# EAGLE design ROCKBLOCK_interface (EAGLE 9.2.2)
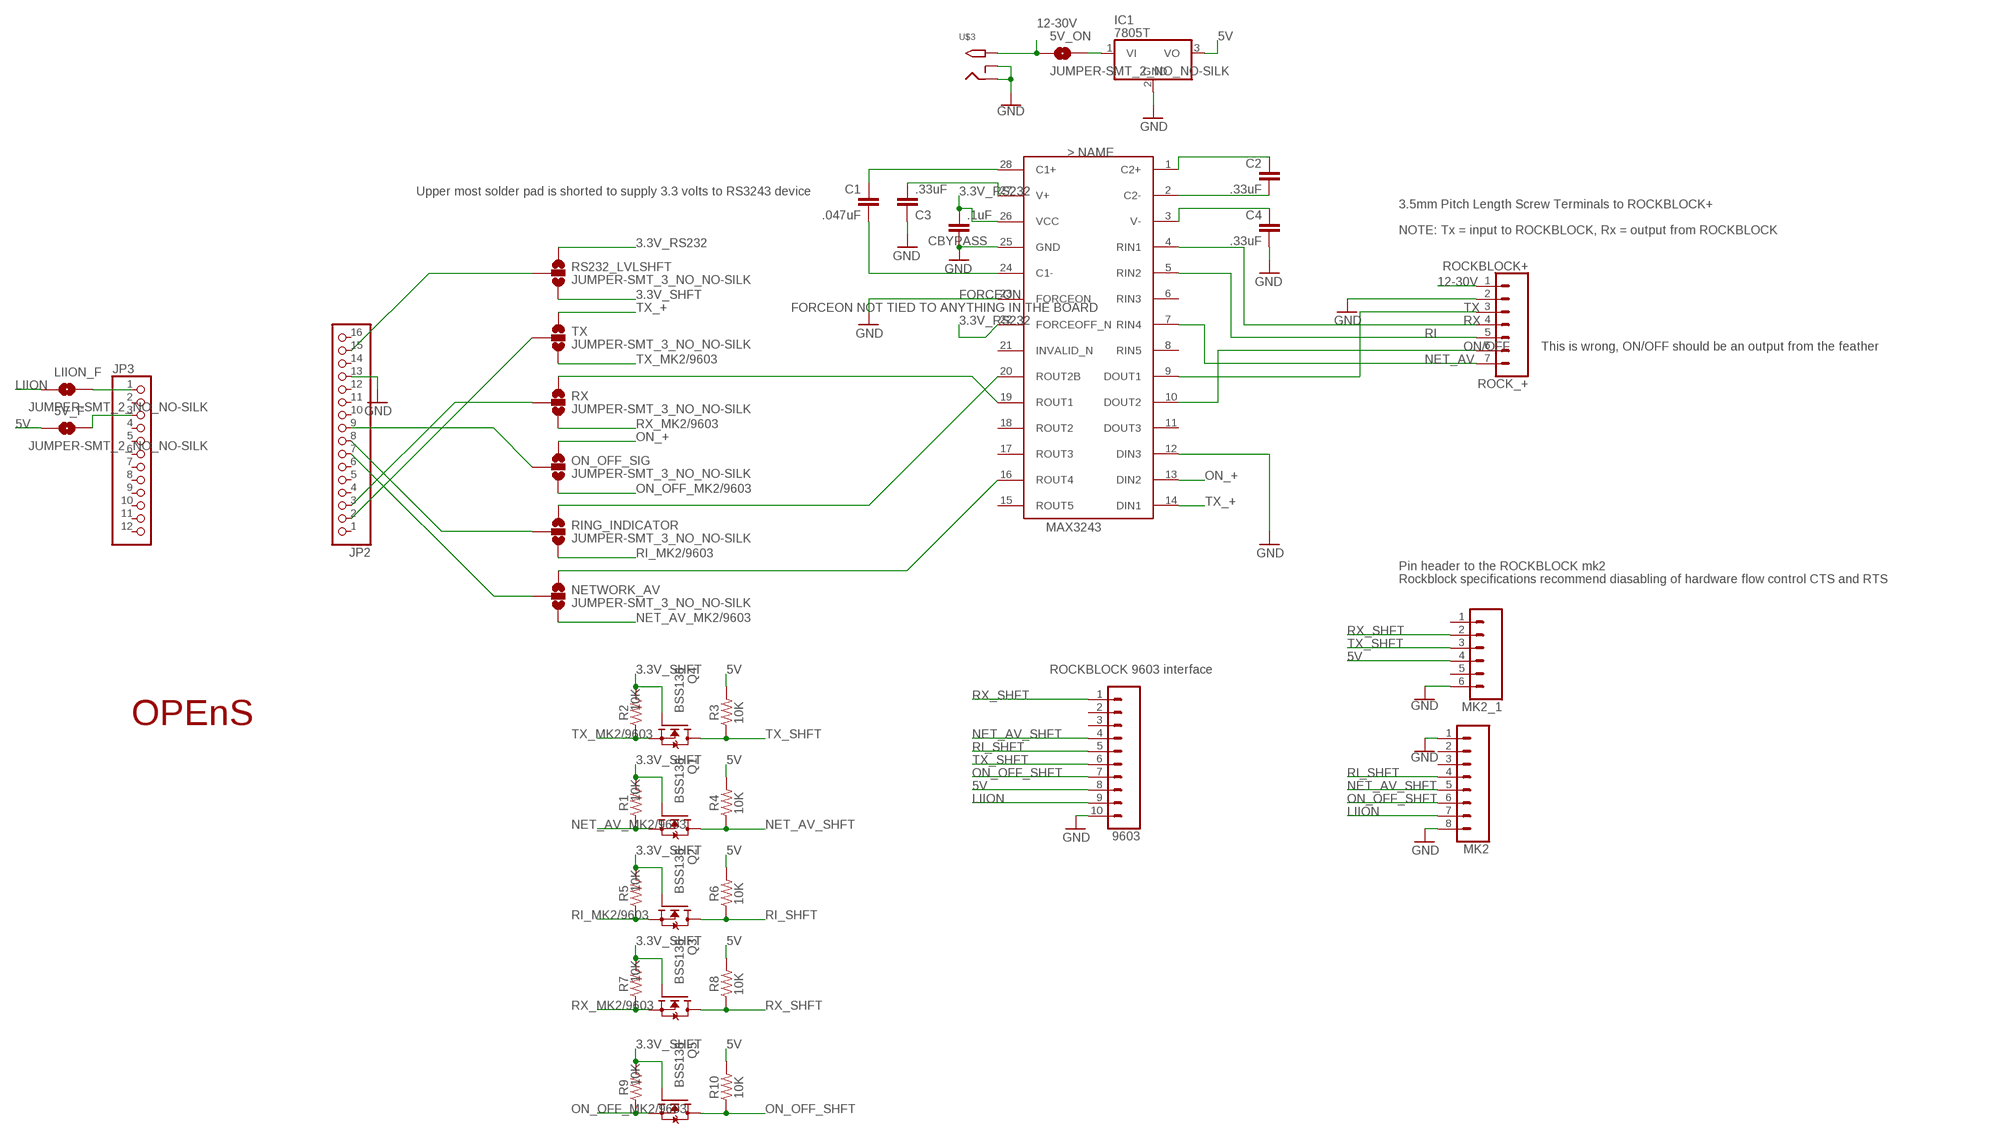
[diagram p0: schematic, sheet 1]

## Parts
5V_F  JUMPER-SMT_2_NO_NO-SILK  [SMT-JUMPER_2_NO_NO-SILK]
5V_ON  JUMPER-SMT_2_NO_NO-SILK  [SMT-JUMPER_2_NO_NO-SILK]
9603  CONN_10"  [1X10]
C1  .047uF  CC1206  [C1206]
C2  .33uF  CC1206  [C1206]
C3  .33uF  CC1206  [C1206]
C4  .33uF  CC1206  [C1206]
CBYPASS  .1uF  CC1206  [C1206]
IC1  7805T  [TO220H]
JP2  PINHD-1X16  [1X16]
JP3  PINHD-1X12  [1X12]
LIION_F  JUMPER-SMT_2_NO_NO-SILK  [SMT-JUMPER_2_NO_NO-SILK]
MK2  CONN_08NO_SILK_FEMALE_PTH  [1X08_NO_SILK]
MK2_1  CONN_06NO_SILK_FEMALE_PTH  [1X06_NO_SILK]
NETWORK_AV  JUMPER-SMT_3_NO_NO-SILK  [SMT-JUMPER_3_NO_NO-SILK]
ON_OFF_SIG  JUMPER-SMT_3_NO_NO-SILK  [SMT-JUMPER_3_NO_NO-SILK]
Q1  BSS138  [SOT23]
Q2  BSS138  [SOT23]
Q3  BSS138  [SOT23]
Q4  BSS138  [SOT23]
Q5  BSS138  [SOT23]
R1  10K  1.8MOHM  [0603]
R2  10K  1.8MOHM  [0603]
R3  10K  1.8MOHM  [0603]
R4  10K  1.8MOHM  [0603]
R5  10K  1.8MOHM  [0603]
R6  10K  1.8MOHM  [0603]
R7  10K  1.8MOHM  [0603]
R8  10K  1.8MOHM  [0603]
R9  10K  1.8MOHM  [0603]
R10  10K  1.8MOHM  [0603]
RING_INDICATOR  JUMPER-SMT_3_NO_NO-SILK  [SMT-JUMPER_3_NO_NO-SILK]
ROCK_+  ROCKBLOCK+  CONN_073.5MM-7  [SCREWTERMINAL-3.5MM-7]
RS232_LVLSHFT  JUMPER-SMT_3_NO_NO-SILK  [SMT-JUMPER_3_NO_NO-SILK]
RX  JUMPER-SMT_3_NO_NO-SILK  [SMT-JUMPER_3_NO_NO-SILK]
TX  JUMPER-SMT_3_NO_NO-SILK  [SMT-JUMPER_3_NO_NO-SILK]
U$1  MAX3243  [SSOP-28]
U$2  OPENS-LOGO  [OPENS-LOGO]
U$3  2.1MMJACKTHM  [PJ-102A]

## Nets
3.3V_RS232: CBYPASS.2 RS232_LVLSHFT.1 U$1.22(FORCEOFF_N) U$1.26(VCC)
3.3V_SHFT: Q1.1(G) Q2.1(G) Q3.1(G) Q4.1(G) Q5.1(G) R1.2 R2.2 R5.2 R7.2 R9.2 RS232_LVLSHFT.3
5V: 5V_F.1 9603.8 IC1.3(VO) MK2_1.4 R3.2 R4.2 R6.2 R8.2 R10.2
12-30V: 5V_ON.1 ROCK_+.1 U$3.TIP
C1+: C1.1 U$1.28(C1+)
FORCEON: U$1.23(FORCEON) ; supply symbol labelled GND
GND: 9603.10 C3.1 C4.2 CBYPASS.1 IC1.2(GND) JP2.13 MK2.1 MK2.8 MK2_1.6 ROCK_+.2 U$1.12(DIN3) U$1.25(GND) U$3.RING U$3.RING_SW
LIION: 9603.9 LIION_F.1 MK2.7
N$1: C2.1 U$1.1(C2+)
N$2: C2.2 U$1.2(C2-)
N$3: C4.1 U$1.3(V-)
N$4: JP2.2 TX.2
N$5: 5V_F.2 JP3.3
N$6: C1.2 U$1.24(C1-)
N$7: RX.1 U$1.19(ROUT1)
N$8: JP2.3 RX.2
N$10: C3.2 U$1.27(V+)
N$11: JP2.7 NETWORK_AV.2
N$12: JP3.1 LIION_F.2
N$13: NETWORK_AV.1 U$1.16(ROUT4)
N$14: JP2.8 RING_INDICATOR.2
N$15: JP2.9 ON_OFF_SIG.2
N$16: 5V_ON.2 IC1.1(VI)
N$17: JP2.15 RS232_LVLSHFT.2
N$19: RING_INDICATOR.1 U$1.20(ROUT2B)
NET_AV: ROCK_+.7 U$1.7(RIN4)
NET_AV_MK2/9603: NETWORK_AV.3 Q1.2(S) R1.1
NET_AV_SHFT: 9603.4 MK2.5 Q1.3(D) R4.1
ON/OFF: ROCK_+.6 U$1.10(DOUT2)
ON_+: ON_OFF_SIG.1 U$1.13(DIN2)
ON_OFF_MK2/9603: ON_OFF_SIG.3 Q5.2(S) R9.1
ON_OFF_SHFT: 9603.7 MK2.6 Q5.3(D) R10.1
RI: ROCK_+.5 U$1.5(RIN2)
RI_MK2/9603: Q2.2(S) R5.1 RING_INDICATOR.3
RI_SHFT: 9603.5 MK2.4 Q2.3(D) R6.1
RX: ROCK_+.4 U$1.4(RIN1)
RX_MK2/9603: Q3.2(S) R7.1 RX.3
RX_SHFT: 9603.1 MK2_1.2 Q3.3(D) R8.1
TX: ROCK_+.3 U$1.9(DOUT1)
TX_+: TX.1 U$1.14(DIN1)
TX_MK2/9603: Q4.2(S) R2.1 TX.3
TX_SHFT: 9603.6 MK2_1.3 Q4.3(D) R3.1
Unconnected: 9603.2 9603.3 JP2.1 JP2.4 JP2.5 JP2.6 JP2.10 JP2.11 JP2.12 JP2.14 JP2.16 JP3.2 JP3.4 JP3.5 JP3.6 JP3.7 JP3.8 JP3.9 JP3.10 JP3.11 JP3.12 MK2.2 MK2.3 MK2_1.1 MK2_1.5 U$1.6(RIN3) U$1.8(RIN5) U$1.11(DOUT3) U$1.15(ROUT5) U$1.17(ROUT3) U$1.18(ROUT2) U$1.21(INVALID_N)

## Notes on the sheet
- Upper most solder pad is shorted to supply 3.3 volts to RS3243 device
- 3.5mm Pitch Length Screw Terminals to ROCKBLOCK+
- NOTE: Tx = input to ROCKBLOCK, Rx = output from ROCKBLOCK
- FORCEON NOT TIED TO ANYTHING IN THE BOARD
- This is wrong, ON/OFF should be an output from the feather
- Pin header to the ROCKBLOCK mk2
- Rockblock specifications recommend diasabling of hardware flow control CTS and RTS
- ROCKBLOCK 9603 interface

## Library data of the parts
5V_F 5V_ON LIION_F = SparkFun-Jumpers:JUMPER-SMT_2_NO: Normally open jumper This jumper has two pads in close proximity to each other. Apply solder to close the connection. Round pads are easier to solder for beginners, but are a lot larger. SparkFun Product that uses the round pads: SparkFun EL Sequencer <https://www.sparkfun.com/products/12781>
9603 = SparkFun-Connectors:CONN_10: Multi connection point. Often used as Generic Header-pin footprint for 0.1 inch spaced/style header connections On any of the 0.1 inch spaced packages, you can populate with these: Break Away Headers - Straight <https://www.sparkfun.com/products/116> (PRT-00116) Break Away Male Headers - Right Angle <https://www.sparkfun.com/products/553> (PRT-00553) Female Headers <https://www.sparkfun.com/products/115> (PRT-00115) Break Away Headers - Machine Pin <https://www.sparkfun.com/products/117> (PRT-00117) Break Away Female Headers - Swiss Machine Pin <https://www.sparkfun.com/products/743> (PRT-00743) Arduino Stackable Header - 10 Pin <https://www.sparkfun.com/products/11376> (PRT-11376) For SCREWTERMINALS and SPRING TERMINALS visit here: Screw Terimnals on SparkFun.com <https://www.sparkfun.com/search/results?term=Screw+Terminals> (5mm/3.5mm/2.54mm spacing) This device is also useful as a general connection point to wire up your design to another part of your project. Our various solder wires solder well into these plated through hole pads. Hook-Up Wire - Assortment (Stranded, 22 AWG) <https://www.sparkfun.com/products/11375> (PRT-11375) Hook-Up Wire - Assortment (Solid Core, 22 AWG) <https://www.sparkfun.com/products/11367> (PRT-11367) View the entire wire category on our website here <https://www.sparkfun.com/categories/141> Special notes: Molex polarized connector foot print use with SKU : PRT-08231 with associated crimp pins and housings. 1MM SMD Version SKU: PRT-10208 NOTES ON THE VARIANTS LOCK and LOCK_LONGPADS... This footprint was designed to help hold the alignment of a through-hole component (i.e. 6-pin header) while soldering it into place. You may notice that each hole has been shifted either up or down by 0.005 of an inch from it's more standard position (which is a perfectly straight line). This slight alteration caused the pins (the squares in the middle) to touch the edges of the holes. Because they are alternating, it causes a "brace" to hold the component in place. 0.005 has proven to be the perfect amount of "off-center" position when using our standard breakaway headers. Although looks a little odd when you look at the bare footprint, once you have a header in there, the alteration is very hard to notice. Also,if you push a header all the way into place, it is covered up entirely on the bottom side.; PROD_ID: CONN-11563
C1-C4 CBYPASS = eagle-ltspice:C: CAPACITOR, European symbol; SPICEMODEL: NONE; SPICEPREFIX: C
IC1 = adafruit:78*: Positive VOLTAGE REGULATOR Added bigger pads to the TO-92 package
JP2 = pinhead:PINHD-1X16: PIN HEADER
JP3 = pinhead:PINHD-1X12: PIN HEADER
MK2 = SparkFun-Connectors:CONN_08: Multi connection point. Often used as Generic Header-pin footprint for 0.1 inch spaced/style header connections On any of the 0.1 inch spaced packages, you can populate with these: Break Away Headers - Straight <https://www.sparkfun.com/products/116> (PRT-00116) Break Away Male Headers - Right Angle <https://www.sparkfun.com/products/553> (PRT-00553) Female Headers <https://www.sparkfun.com/products/115> (PRT-00115) Break Away Headers - Machine Pin <https://www.sparkfun.com/products/117> (PRT-00117) Break Away Female Headers - Swiss Machine Pin <https://www.sparkfun.com/products/743> (PRT-00743) Arduino Stackable Header - 8 Pin <https://www.sparkfun.com/products/9279> (PRT-09279) For SCREWTERMINALS and SPRING TERMINALS visit here: Screw Terimnals on SparkFun.com <https://www.sparkfun.com/search/results?term=Screw+Terminals> (5mm/3.5mm/2.54mm spacing) This device is also useful as a general connection point to wire up your design to another part of your project. Our various solder wires solder well into these plated through hole pads. Hook-Up Wire - Assortment (Stranded, 22 AWG) <https://www.sparkfun.com/products/11375> (PRT-11375) Hook-Up Wire - Assortment (Solid Core, 22 AWG) <https://www.sparkfun.com/products/11367> (PRT-11367) View the entire wire category on our website here <https://www.sparkfun.com/categories/141> Special notes: Molex polarized connector foot print use with SKU : PRT-08231 with associated crimp pins and housings. 1MM SMD Version SKU: PRT-10208 NOTES ON THE VARIANTS LOCK and LOCK_LONGPADS... This footprint was designed to help hold the alignment of a through-hole component (i.e. 6-pin header) while soldering it into place. You may notice that each hole has been shifted either up or down by 0.005 of an inch from it's more standard position (which is a perfectly straight line). This slight alteration caused the pins (the squares in the middle) to touch the edges of the holes. Because they are alternating, it causes a "brace" to hold the component in place. 0.005 has proven to be the perfect amount of "off-center" position when using our standard breakaway headers. Although looks a little odd when you look at the bare footprint, once you have a header in there, the alteration is very hard to notice. Also,if you push a header all the way into place, it is covered up entirely on the bottom side.; PROD_ID: CONN-08438
MK2_1 = SparkFun-Connectors:CONN_06: Multi connection point. Often used as Generic Header-pin footprint for 0.1 inch spaced/style header connections On any of the 0.1 inch spaced packages, you can populate with these: Break Away Headers - Straight <https://www.sparkfun.com/products/116> (PRT-00116) Break Away Male Headers - Right Angle <https://www.sparkfun.com/products/553> (PRT-00553) Female Headers <https://www.sparkfun.com/products/115> (PRT-00115) Break Away Headers - Machine Pin <https://www.sparkfun.com/products/117> (PRT-00117) Break Away Female Headers - Swiss Machine Pin <https://www.sparkfun.com/products/743> (PRT-00743) Arduino Stackable Header - 6 Pin <https://www.sparkfun.com/products/9280> (PRT-09280) For SCREWTERMINALS and SPRING TERMINALS visit here: Screw Terimnals on SparkFun.com <https://www.sparkfun.com/search/results?term=Screw+Terminals> (5mm/3.5mm/2.54mm spacing) This device is also useful as a general connection point to wire up your design to another part of your project. Our various solder wires solder well into these plated through hole pads. Hook-Up Wire - Assortment (Stranded, 22 AWG) <https://www.sparkfun.com/products/11375> (PRT-11375) Hook-Up Wire - Assortment (Solid Core, 22 AWG) <https://www.sparkfun.com/products/11367> (PRT-11367) View the entire wire category on our website here <https://www.sparkfun.com/categories/141>; PROD_ID: CONN-08437
NETWORK_AV ON_OFF_SIG RING_INDICATOR RS232_LVLSHFT RX TX = SparkFun-Jumpers:JUMPER-SMT_3_NO: Normally open jumper This jumper has three pads in close proximity to each other. Apply solder to close the connection(s).
Q1-Q5 = bss138_10:BSS138: BSS138 N-Channel Logic Level Enhancement Mode Field Effect Transistor Source: http://www.fairchildsemi.com/datasheets/BS/BSS138.pdf; MF: Fairchild; MPN: BSS138; OC_FARNELL: 9845330; OC_NEWARK: 67R2009
R1-R10 = SparkFun-Resistors:1.8MOHM: 1.8 MOhms ±5% 0.1W, 1/10W Chip Resistor 0603; PROD_ID: RES-13994; VALUE: 1.8M
ROCK_+ = SparkFun-Connectors:CONN_07: Multi connection point. Often used as Generic Header-pin footprint for 0.1 inch spaced/style header connections On any of the 0.1 inch spaced packages, you can populate with these: Break Away Headers - Straight <https://www.sparkfun.com/products/116> (PRT-00116) Break Away Male Headers - Right Angle <https://www.sparkfun.com/products/553> (PRT-00553) Female Headers <https://www.sparkfun.com/products/115> (PRT-00115) Break Away Headers - Machine Pin <https://www.sparkfun.com/products/117> (PRT-00117) Break Away Female Headers - Swiss Machine Pin <https://www.sparkfun.com/products/743> (PRT-00743) For SCREWTERMINALS and SPRING TERMINALS visit here: Screw Terimnals on SparkFun.com <https://www.sparkfun.com/search/results?term=Screw+Terminals> (5mm/3.5mm/2.54mm spacing) This device is also useful as a general connection point to wire up your design to another part of your project. Our various solder wires solder well into these plated through hole pads. Hook-Up Wire - Assortment (Stranded, 22 AWG) <https://www.sparkfun.com/products/11375> (PRT-11375) Hook-Up Wire - Assortment (Solid Core, 22 AWG) <https://www.sparkfun.com/products/11367> (PRT-11367) View the entire wire category on our website here <https://www.sparkfun.com/categories/141> Special notes: Molex polarized connector foot print use with SKU : PRT-08231 with associated crimp pins and housings. 1MM SMD Version SKU: PRT-10208 NOTES ON THE VARIANTS LOCK and LOCK_LONGPADS... This footprint was designed to help hold the alignment of a through-hole component (i.e. 6-pin header) while soldering it into place. You may notice that each hole has been shifted either up or down by 0.005 of an inch from it's more standard position (which is a perfectly straight line). This slight alteration caused the pins (the squares in the middle) to touch the edges of the holes. Because they are alternating, it causes a "brace" to hold the component in place. 0.005 has proven to be the perfect amount of "off-center" position when using our standard breakaway headers. Although looks a little odd when you look at the bare footprint, once you have a header in there, the alteration is very hard to notice. Also,if you push a header all the way into place, it is covered up entirely on the bottom side.
U$1 = ftdi4:MAX3243: MAX3243 RS232 interface 5 receive lines 3 line drives 5V or 3.3V operating voltage
U$2 = opens-logo:OPENS-LOGO: OPENS Lab Logo
U$3 = adafruit:2.1MMJACK: 2.1mm x 5.5mm THM DC jack with internal switch. Digikey part #PJ-102A, 4UCON part #05537 2.1mm x 5.5mm SMT DC jack with internal switch. Digikey part #PJ-002A-SMT, 4UCON part #03267 By microbuilder.eu & adafruit.com

## Net classes
0 default: width 0.305 mm, drill 0.508 mm, clearance 0.254 mm
1 Power: width 0.635 mm, drill 1.27 mm, clearance 0.508 mm

## Board
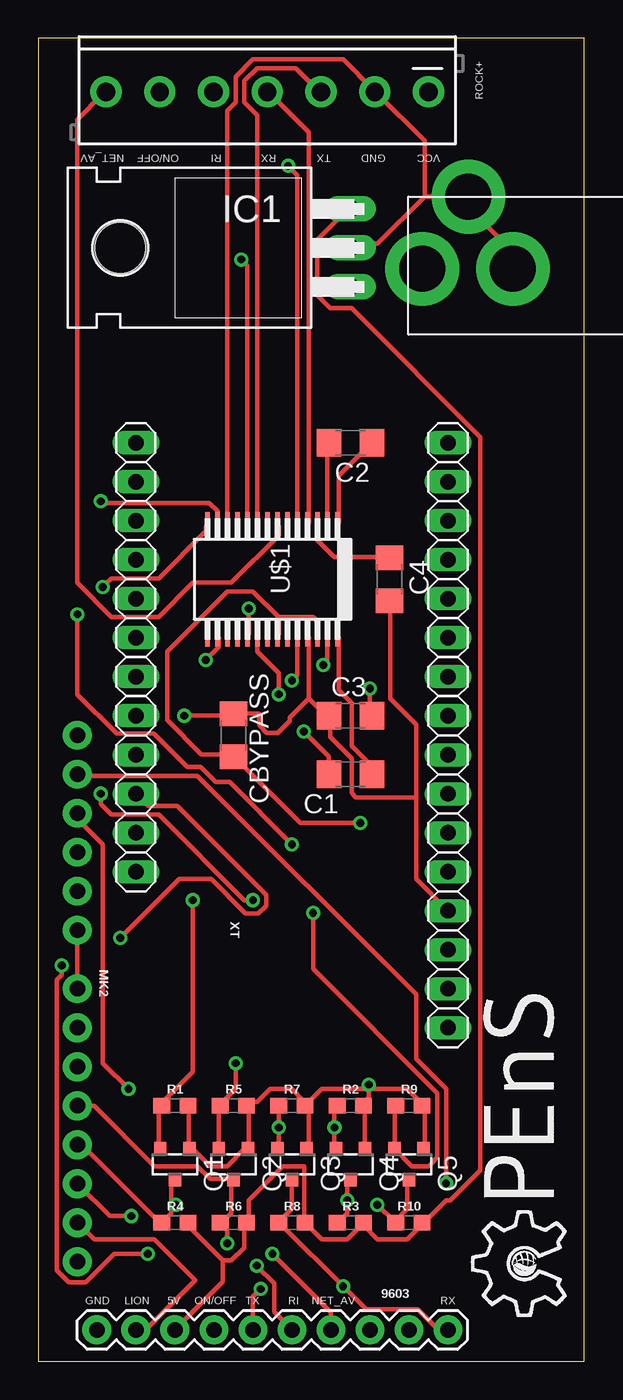
[diagram p1: board, top side]
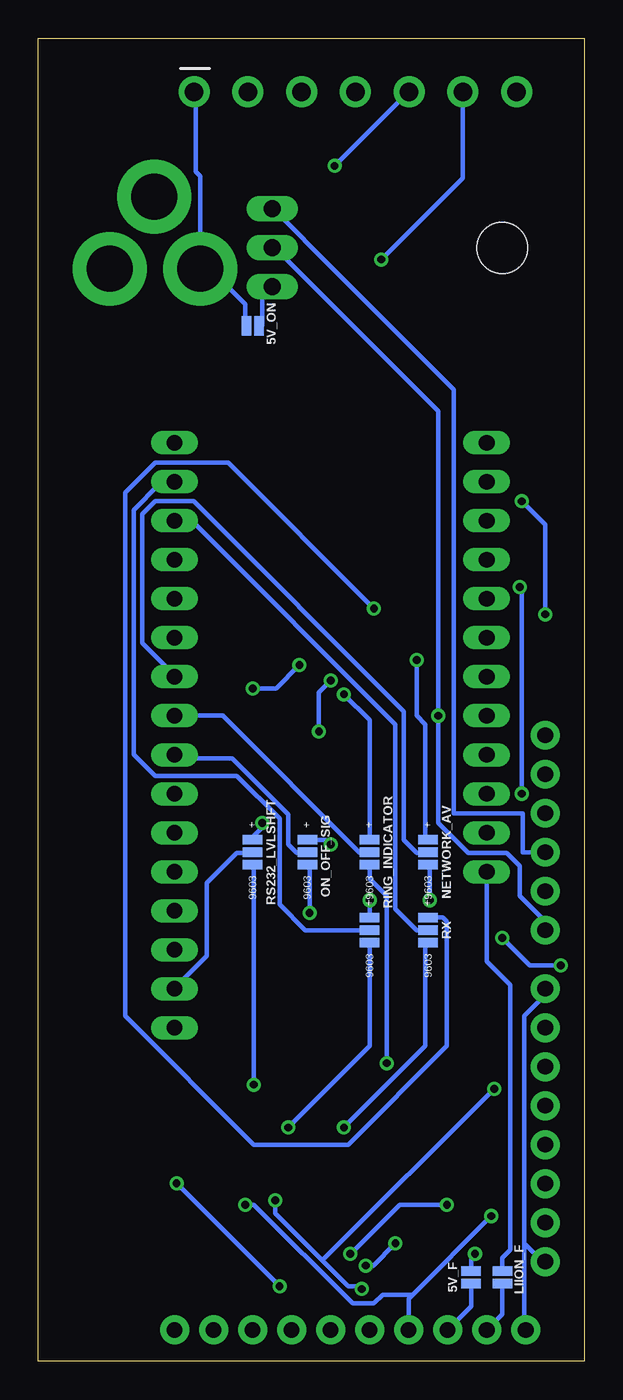
[diagram p2: board, bottom side, seen from below]

Size 35.54 x 86.16 mm. Coordinates in mm from the lower left corner, seen from the top.
Outline: 0,0 35.54,0 35.54,86.16 0,86.16 0,0
Copper layers (1*16): Top 0.035mm / dielectric 1.5mm / Bottom 0.035mm
Design rules "default": minimum track width 6mil, minimum drill 0.35mm, track to track 6mil, track to pad 6mil, pad to pad 6mil, via to via 6mil, smd to smd 6mil, copper to edge 40mil, drill to drill 6mil, minimum pad ring 10mil, minimum via ring 8mil, stop-mask expansion 4mil, vias tented up to drill 0mil, thermal gap 10mil

### Footprints (pad centres in the part's own frame; a part is rotated, then mirrored left to right if it is on the bottom)
SMT-JUMPER_2_NO_NO-SILK = smd 0.635 x 1.27: 1 -0.406,0; 2 0.406,0
1X10 = drill 1.016 pad 1.88: 1 0,0; 2 2.54,0; 3 5.08,0; 4 7.62,0; 5 10.16,0; 6 12.7,0; 7 15.24,0; 8 17.78,0; 9 20.32,0; 10 22.86,0
C1206 = smd 1.6 x 1.8: 1 -1.4,0; 2 1.4,0
TO220H = drill 1.118 long: 1 -2.54,-10.16; 2 0,-10.16; 3 2.54,-10.16 | hole 3.302: 0,4.826
1X16 = drill 1.016 long: 1 -19.05,0; 2 -16.51,0; 3 -13.97,0; 4 -11.43,0; 5 -8.89,0; 6 -6.35,0; 7 -3.81,0; 8 -1.27,0; 9 1.27,0; 10 3.81,0; 11 6.35,0; 12 8.89,0; 13 11.43,0; 14 13.97,0; 15 16.51,0; 16 19.05,0
1X12 = drill 1.016 long: 1 -13.97,0; 2 -11.43,0; 3 -8.89,0; 4 -6.35,0; 5 -3.81,0; 6 -1.27,0; 7 1.27,0; 8 3.81,0; 9 6.35,0; 10 8.89,0; 11 11.43,0; 12 13.97,0
1X08_NO_SILK = drill 1.016 pad 1.88: 1 0,0; 2 2.54,0; 3 5.08,0; 4 7.62,0; 5 10.16,0; 6 12.7,0; 7 15.24,0; 8 17.78,0
1X06_NO_SILK = drill 1.016 pad 1.88: 1 0,0; 2 2.54,0; 3 5.08,0; 4 7.62,0; 5 10.16,0; 6 12.7,0
SMT-JUMPER_3_NO_NO-SILK = smd 0.635 x 1.27: 1 -0.813,0; 2 0,0; 3 0.813,0
SOT23 = smd 0.8 x 0.9: 1 -0.95,-1; 2 0.95,-1; 3 0,1
0603 = smd 1.1 x 1: 1 -0.85,0; 2 0.85,0
SCREWTERMINAL-3.5MM-7 = drill 1.2 pad 2.032: 1 0,0; 2 3.5,0; 3 7,0; 4 10.5,0; 5 14,0; 6 17.5,0; 7 21,0
SSOP-28 = smd 0.3 x 1.5: 1 -4.225,-3.625; 2 -3.575,-3.625; 3 -2.925,-3.625; 4 -2.275,-3.625; 5 -1.625,-3.625; 6 -0.975,-3.625; 7 -0.325,-3.625; 8 0.325,-3.625; 9 0.975,-3.625; 10 1.625,-3.625; 11 2.275,-3.625; 12 2.925,-3.625; 13 3.575,-3.625; 14 4.225,-3.625; 15 4.225,3.625; 16 3.575,3.625; 17 2.925,3.625; 18 2.275,3.625; 19 1.625,3.625; 20 0.975,3.625; 21 0.325,3.625; 22 -0.325,3.625; 23 -0.975,3.625; 24 -1.625,3.625; 25 -2.275,3.625; 26 -2.925,3.625; 27 -3.575,3.625; 28 -4.225,3.625
PJ-102A = drill 3 pad 4.8: RING 0.1,-3.39; RING_SW -4.6,-6.29; TIP 0.1,-9.29

### Placement (x,y rotation side)
5V_F  7.37,5.46 90 bottom
5V_ON  21.59,67.44 0 bottom
9603  26.67,2.03 180 top
C1  20.32,38.23 180 top
C2  20.32,59.82 180 top
C3  20.32,42.04 0 top
C4  22.86,50.93 270 top
CBYPASS  12.7,40.77 270 top
IC1  10.16,72.52 90 top
JP2  26.67,40.77 270 top
JP3  6.35,45.85 90 top
LIION_F  5.33,5.46 90 bottom
MK2  2.54,24.26 270 top
MK2_1  2.54,40.77 270 top
NETWORK_AV  10.16,33.15 270 bottom
ON_OFF_SIG  18.03,33.15 270 bottom
Q1  8.89,12.83 180 top
Q2  12.7,12.83 180 top
Q3  16.51,12.83 180 top
Q4  20.32,12.83 180 top
Q5  24.13,12.83 180 top
R1  8.89,16.64 0 top
R2  20.32,16.64 0 top
R3  20.32,9.02 0 top
R4  8.89,9.02 0 top
R5  12.7,16.64 0 top
R6  12.7,9.02 0 top
R7  16.51,16.64 0 top
R8  16.51,9.02 0 top
R9  24.13,16.64 0 top
R10  24.13,9.02 0 top
RING_INDICATOR  13.97,33.15 270 bottom
ROCK_+  25.4,82.68 180 top
RS232_LVLSHFT  21.59,33.15 270 bottom
RX  10.16,28.07 270 bottom
TX  13.97,28.07 270 bottom
U$1  15.24,50.93 180 top
U$2  38.1,2.67 90 top
U$3  34.29,71.25 270 top

### Tracks (layer width: path | path; a pad name or v marks a point on that pad's centre or on a via)
3.3V_RS232  (via drill 0.51)
  Top 0.305: 15.65,48.46 15.65,47.35 U$1.22 | 15.65,48.46 17.88,48.46 18.16,48.18 18.16,47.35 U$1.26 | v20.95,35.05 17.04,35.05 12.85,39.24 CBYPASS.2 12.57,39.52 10.62,39.52 8.38,41.76 8.38,46.23 12.29,50.14 13.97,50.14 15.65,48.46
  Bottom 0.305: v20.95,35.05 20.95,34.77 21.51,34.21 RS232_LVLSHFT.1
3.3V_SHFT  (via drill 0.51)
  Top 0.305: R1.2 9.78,16.61 9.78,14.1 Q1.1 10.06,13.82 11.18,12.7 12.29,12.7 13.41,13.82 Q2.1 13.69,14.1 13.69,16.61 R5.2 13.69,16.89 14.25,16.89 15.09,17.73 16.48,17.73 17.32,16.89 R7.2 | Q5.1 25.15,14.1 25.15,16.61 R9.2 24.87,16.89 24.03,17.73 21.51,17.73 | Q3.1 17.6,14.1 17.6,16.61 R7.2 | Q4.1 21.23,14.1 21.23,16.61 R2.2 21.23,16.89 21.51,17.17 21.51,17.73 | 21.51,17.73 18.44,17.73 17.6,16.89 R7.2 | 21.51,17.73 v21.51,18.01
  Bottom 0.305: v21.51,18.01 21.51,32.26 RS232_LVLSHFT.3
5V
  Top 0.305: 12.01,6.55 9.78,8.79 R4.2 | 12.01,6.55 12.57,6.55 13.41,7.39 13.41,8.79 R6.2 13.69,9.07 13.69,10.46 15.93,12.7 17.32,12.7 17.32,9.07 R8.2 17.6,8.79 18.44,7.95 20.12,7.95 20.95,8.79 R3.2 21.23,8.79 22.07,7.95 24.03,7.95 24.87,8.79 R10.2 25.15,9.07 26.54,10.46 26.82,10.46 28.78,12.42 28.78,60.2 20.4,68.58 19,68.58 18.16,69.42 18.16,73.05 20.12,75.01 IC1.3 | 9603.8 12.01,5.16 12.01,6.55
  Bottom 0.305: 20.12,75.01 IC1.3 20.26,75.06 18.24,73.03 18.24,73.02 8.48,63.27 8.48,35.69 4,35.69 4,33.15 MK2_1.4 | 5V_F.1 7.37,3.56 9603.8
12-30V
  Bottom 0.305: 5V_ON.1 22.07,67.46 22.07,68.86 24.36,71.15 U$3.TIP 25,77.17 25.3,77.47 25.3,82.63 | 25.15,82.55 25.3,82.63 | 25.3,82.63 ROCK_+.1
C1+
  Top 0.305: U$1.28 19.56,47.07 19.56,43.71 20.4,42.88 20.4,40.08 21.51,38.96 21.51,38.41 C1.1
GND  (via drill 0.51)
  Top 0.305: 25.15,75.84 22.07,72.77 20.4,72.77 IC1.2 | 27.3,75.84 25.15,75.84 | U$1.12 12.29,54.61 12.29,81.43 12.85,81.99 12.85,83.67 13.97,84.78 19.84,84.78 21.79,82.83 ROCK_+.2 22.07,82.55 25.15,79.48 25.15,75.84 | MK2.1 2.52,24.43 2.52,28.07 MK2_1.6 | 17.6,43.16 17.6,47.07 U$1.25 | 17.6,43.16 18.72,42.04 C3.1 19,42.04 19,40.64 20.4,39.24 20.4,37.01 20.68,36.73 24.59,36.73 | 12.85,42.32 CBYPASS.1 | 24.59,36.73 24.59,31.42 JP2.13 | 24.59,36.73 24.59,41.48 22.91,43.16 22.91,49.3 C4.2 | v9.5,42.04 12.57,42.04 CBYPASS.1 | CBYPASS.1 14.35,42.17 14.38,42.14 14.38,41.43 14.88,40.92 15.6,40.92 16.36,41.68 16.36,41.91 17.6,43.16 | U$3.RING 30.9,72.25 27.3,75.84 | U$3.RING_SW 27.3,75.84
  Bottom 0.305: 3.91,7.67 3.91,22.48 2.79,23.6 2.79,24.15 MK2.1 | 3.91,7.67 2.79,6.55 MK2.8 | MK2_1.6 2.79,28.07 2.79,28.9 4.19,30.3 4.19,32.26 5.03,33.1 7.54,33.1 9.5,35.05 v9.5,42.04 9.5,61.87 20.12,72.49 IC1.2 | 3.91,7.67 3.91,2.13 9603.10
LIION
  Top 0.305: MK2.7 2.79,8.79 3.63,7.95 7.54,7.95 10.22,5.27 6.99,2.03 9603.9
  Bottom 0.305: LIION_F.1 5.33,3.05 9603.9
N$1
  Top 0.305: U$1.1 19.56,54.61 19.56,57.68 21.51,59.64 C2.1
N$2
  Top 0.305: U$1.2 18.82,59.71 C2.2
N$3
  Top 0.305: U$1.3 18.16,54.33 18.16,53.49 19.28,52.38 22.63,52.38 C4.1
N$4
  Bottom 0.305: TX.2 18.16,28.07 19.84,29.74 19.84,35.33 22.63,38.12 27.94,38.12 29.34,39.52 29.34,55.45 27.66,57.12 26.82,57.12 JP2.2
N$5  (via drill 0.51)
  Top 0.305: JP3.3 7.14,36.17 9.04,36.17 14.83,30.38 14.83,29.66 14.33,29.16 13.48,29.16 11.25,31.39 9.17,31.39 v5.33,27.56 | v1.52,25.78 1.52,25.14 1.19,24.81 1.19,5.92 1.98,5.13 3.1,5.13 4.95,6.98 v7.11,6.98
  Bottom 0.305: v7.11,6.98 7.37,6.73 5V_F.2 | v1.52,25.78 3.56,25.78 v5.33,27.56
N$6  (via drill 0.51)
  Top 0.305: U$1.24 16.86,44.68 v16.51,44.32 | v17.27,41.02 18.92,39.37 C1.2
  Bottom 0.305: v16.51,44.32 17.27,43.56 v17.27,41.02
N$7  (via drill 0.51)
  Top 0.305: v13.69,49.02 13.69,47.35 U$1.19
  Bottom 0.305: v13.69,49.02 23.19,58.52 27.94,58.52 29.9,56.57 29.9,22.48 21.51,14.1 15.37,14.1 8.94,20.52 8.94,28.63 9.22,28.9 10.06,28.9 RX.1
N$8
  Bottom 0.305: RX.2 10.9,28.07 12.29,29.46 12.29,41.48 25.43,54.61 26.54,54.61 JP2.3
N$10  (via drill 0.51)
  Top 0.305: U$1.27 18.82,45.61 v18.54,45.34 | v21.59,43.82 21.59,42.17 C3.2
  Bottom 0.305: v18.54,45.34 20.07,43.82 v21.59,43.82
N$11
  Bottom 0.305: NETWORK_AV.2 10.34,33.1 10.9,33.1 11.73,33.93 11.73,42.32 25.43,56.01 27.94,56.01 28.78,55.17 28.78,46.79 26.82,44.83 JP2.7
N$12
  Bottom 0.305: LIION_F.2 5.33,6.73 4.83,7.24 4.83,24.51 6.35,26.04 JP3.1
N$13  (via drill 0.51)
  Top 0.305: v10.9,45.67 11.73,46.51 11.73,47.07 U$1.16
  Bottom 0.305: v10.9,45.67 10.9,42.04 10.34,41.48 10.34,34.21 NETWORK_AV.1
N$14
  Bottom 0.305: JP2.8 23.55,42.04 14.61,33.1 13.97,33.1 RING_INDICATOR.2
N$15
  Bottom 0.305: ON_OFF_SIG.2 18.14,33.1 18.72,33.1 19.28,33.66 19.28,35.61 22.91,39.24 26.54,39.24 JP2.9
N$16
  Bottom 0.305: 5V_ON.2 20.95,67.46 20.95,69.42 20.4,69.98 IC1.1
N$17
  Bottom 0.305: RS232_LVLSHFT.2 21.79,33.1 22.63,33.1 24.59,31.14 24.59,26.39 26.54,24.43 JP2.15
N$19  (via drill 0.51)
  Top 0.305: v15.65,43.43 15.65,44.83 14.25,46.23 14.25,47.07 U$1.20
  Bottom 0.305: RING_INDICATOR.1 13.97,41.76 v15.65,43.43
NET_AV
  Top 0.305: U$1.7 15.65,54.33 15.65,53.77 12.57,50.7 10.06,50.7 7.82,48.46 4.75,48.46 2.52,50.7 2.52,80.87 4.19,82.55 ROCK_+.7
NET_AV_MK2/9603  (via drill 0.51)
  Top 0.305: Q1.2 7.82,14.1 7.82,16.61 R1.1 8.1,16.89 10.06,18.85 v10.06,30.02
  Bottom 0.305: v10.06,30.02 10.06,32.26 NETWORK_AV.3
NET_AV_SHFT  (via drill 0.51)
  Top 0.305: 8.66,10.19 8.66,9.63 8.1,9.07 | 8.66,10.19 8.66,11.58 Q1.3 | 8.1,9.07 7.98,8.94 2.82,14.1 MK2.5 | 8.1,9.07 R4.1 | 8.66,10.19 v8.94,10.19 | v15.24,6.98 19.05,3.17 9603.4
  Bottom 0.305: v8.94,10.19 12.01,10.19 15.21,6.98 v15.24,6.98
ON/OFF  (via drill 0.51)
  Top 0.305: U$1.10 13.62,71.35 v13.21,71.75
  Bottom 0.305: v13.21,71.75 7.9,77.06 ROCK_+.6
ON_+  (via drill 0.51)
  Top 0.305: v16.51,33.66 12.45,37.72 11.53,37.72 10.57,38.68 9.7,38.68 7.52,40.87 5.1,40.87 2.54,43.43 v2.54,48.64 | v4.06,56.01 4.17,55.91 11.14,55.91 11.66,55.38 U$1.13
  Bottom 0.305: ON_OFF_SIG.1 16.82,33.96 v16.51,33.66 | v2.54,48.64 2.54,54.48 v4.06,56.01
ON_OFF_MK2/9603  (via drill 0.51)
  Top 0.305: R9.1 23.19,16.61 23.19,14.1 Q5.2 24.31,12.7 25.43,12.7 25.98,13.26 25.98,17.45 17.88,25.55 v17.88,29.18
  Bottom 0.305: v17.88,29.18 17.88,32.22 ON_OFF_SIG.3
ON_OFF_SHFT  (via drill 0.51)
  Top 0.305: 23.19,9.07 24.03,9.91 24.03,11.58 Q5.3 | v6.04,9.45 4.65,9.45 MK2.6 | v22.07,10.19 23.19,9.07 | 23.19,9.07 R10.1
  Bottom 0.305: 11.18,4.32 13.13,4.32 13.69,3.76 15.09,3.76 21.51,10.19 v22.07,10.19 | 11.18,4.32 v6.04,9.45 | 9603.7 11.43,4.06 11.18,4.32
RI  (via drill 0.51)
  Top 0.305: U$1.5 16.86,77.24 v16.26,77.85
  Bottom 0.305: v16.26,77.85 11.43,82.68 ROCK_+.5
RI_MK2/9603  (via drill 0.51)
  Top 0.305: Q2.2 11.73,14.1 11.73,16.61 R5.1 12.01,16.89 12.85,17.73 v12.85,19.41
  Bottom 0.305: RING_INDICATOR.3 13.97,31.42 12.85,30.3 v12.85,19.41
RI_SHFT  (via drill 0.51)
  Top 0.305: v12.29,7.67 12.29,8.51 12.01,8.79 R6.1 12.01,9.07 12.57,9.63 12.57,11.58 Q2.3 12.57,11.86 11.18,11.86 10.34,12.7 7.54,12.7 3.63,16.61 2.79,16.61 MK2.4 | v14.22,6.22 14.22,6.17 15.34,5.06 15.34,3.2 9603.5
  Bottom 0.305: v14.22,6.22 13.74,6.22 v12.29,7.67
RX
  Top 0.305: U$1.4 17.6,54.61 17.6,80.03 15.09,82.55 ROCK_+.4
RX_MK2/9603  (via drill 0.51)
  Top 0.305: Q3.2 15.65,14.1 v15.65,15.21 15.65,16.61 R7.1
  Bottom 0.305: v15.65,15.21 10.34,20.52 10.34,27.23 RX.3
RX_SHFT  (via drill 0.51)
  Top 0.305: Q3.3 16.48,11.58 16.48,9.91 15.65,9.07 R8.1 15.93,8.79 v19.84,4.88 | v26.54,11.58 26.54,17.73 24.59,19.68 24.59,23.88 10.34,38.12 2.79,38.12 MK2_1.2 | 20.14,4.57 arc-90 v19.84,4.88 | v19.84,4.88 21.34,3.38 24.69,3.38 26.03,2.03 9603.1
  Bottom 0.305: v19.84,4.88 v26.54,11.58
TX
  Top 0.305: U$1.9 14.25,54.61 14.25,81.15 13.41,81.99 13.41,83.39 14.25,84.23 16.76,84.23 18.16,82.83 ROCK_+.3
TX_+  (via drill 0.51)
  Top 0.305: v13.97,30.02 13.41,30.02 7.82,35.61 4.75,35.61 4.06,36.3 v4.06,36.96 | v4.19,50.42 4.75,50.98 7.82,50.98 10.9,54.05 10.9,54.33 U$1.14
  Bottom 0.305: v13.97,30.02 TX.1 | v4.06,36.96 4.06,50.29 v4.19,50.42
TX_MK2/9603  (via drill 0.51)
  Top 0.305: Q4.2 19.28,14.1 v19.28,15.21 19.28,16.61 R2.1
  Bottom 0.305: TX.3 13.97,20.52 v19.28,15.21
TX_SHFT  (via drill 0.51)
  Top 0.305: Q4.3 20.12,11.58 v20.12,10.46 20.12,9.63 19.56,9.07 R3.1 | v5.87,17.73 4.19,19.41 4.19,33.66 2.79,35.05 2.79,35.61 MK2_1.3 | v14.48,4.7 13.97,4.19 9603.6
  Bottom 0.305: 17.04,6.55 20.12,9.63 v20.12,10.46 | 17.04,6.55 15.37,4.88 14.66,4.88 v14.48,4.7 | 17.04,6.55 v5.87,17.73

### Text on the board
tNames: ROCK+ | NET_AV | ON/OFF | RI | RX | TX | GND | VCC | GND | LION | 5V | ON/OFF | TX | RI | NET_AV | RX
bNames: + | + | + | + | 9603 | 9603 | 9603 | 9603 | + | + | 9603 | 9603